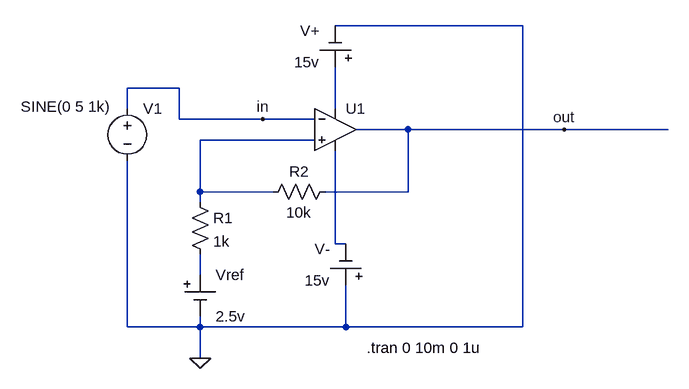
[diagram p0: schematic schmitt trigger.asc]
schmitt trigger.asc, the LTspice schematic file:
Version 4
SHEET 1 980 788
WIRE 752 256 464 256
WIRE 224 352 144 352
WIRE 144 384 144 352
WIRE 464 384 464 320
WIRE 224 400 224 352
WIRE 352 400 224 400
WIRE 432 400 352 400
WIRE 576 416 496 416
WIRE 816 416 576 416
WIRE 976 416 816 416
WIRE 432 432 256 432
WIRE 256 512 256 432
WIRE 368 512 256 512
WIRE 576 512 576 416
WIRE 576 512 448 512
WIRE 256 528 256 512
WIRE 464 592 464 448
WIRE 480 592 464 592
WIRE 256 640 256 608
WIRE 144 720 144 464
WIRE 256 720 256 704
WIRE 256 720 144 720
WIRE 480 720 480 656
WIRE 480 720 256 720
WIRE 752 720 752 256
WIRE 752 720 480 720
WIRE 256 768 256 720
FLAG 256 768 0
FLAG 352 400 in
FLAG 816 416 out
SYMBOL res 240 512 R0
SYMATTR InstName R1
SYMATTR Value 1k
SYMBOL res 464 496 R90
WINDOW 0 0 56 VBottom 2
WINDOW 3 32 56 VTop 2
SYMATTR InstName R2
SYMATTR Value 10k
SYMBOL voltage 144 368 R0
WINDOW 123 0 0 Left 0
WINDOW 39 0 0 Left 0
WINDOW 3 -164 13 Left 2
SYMATTR InstName V1
SYMATTR Value SINE(0 5 1k)
SYMBOL Misc\\cell 256 640 R0
SYMATTR InstName Vref
SYMATTR Value 2.5v
SYMBOL Misc\\cell 480 656 R180
WINDOW 0 24 56 Left 2
WINDOW 3 24 8 Left 2
WINDOW 123 0 0 Left 0
WINDOW 39 0 0 Left 0
SYMATTR InstName V-
SYMATTR Value 15v
SYMBOL Misc\\cell 464 320 R180
WINDOW 0 24 56 Left 2
WINDOW 3 24 8 Left 2
SYMATTR InstName V+
SYMATTR Value 15v
SYMBOL OpAmps\\UniversalOpAmp2 464 416 R0
SYMATTR InstName U1
TEXT 512 752 Left 2 !.tran 0 10m 0 1u

The netlist it stands for:
* schmitt trigger.asc
R1 N002 N004 1k
R2 out N002 10k
V1 in 0 SINE(0 5 1k)
Vref N004 0 2.5v
V- 0 N003 15v
V+ N001 0 15v
XU1 N002 in N001 N003 out level2 Avol=1Meg GBW=10Meg Slew=10Meg Ilimit=25m Rail=0 Vos=0 En=0 Enk=0 In=0 Ink=0 Rin=500Meg  ; pins In+ In- V+ V- OUT
.tran 0 10m 0 1u
.lib UniversalOpAmp2.lib
.backanno
.end